# Altium schematic sheet Sheet2.SchDoc
size 420 x 297 mm; SheetNumber: 1; SheetTotal: 1
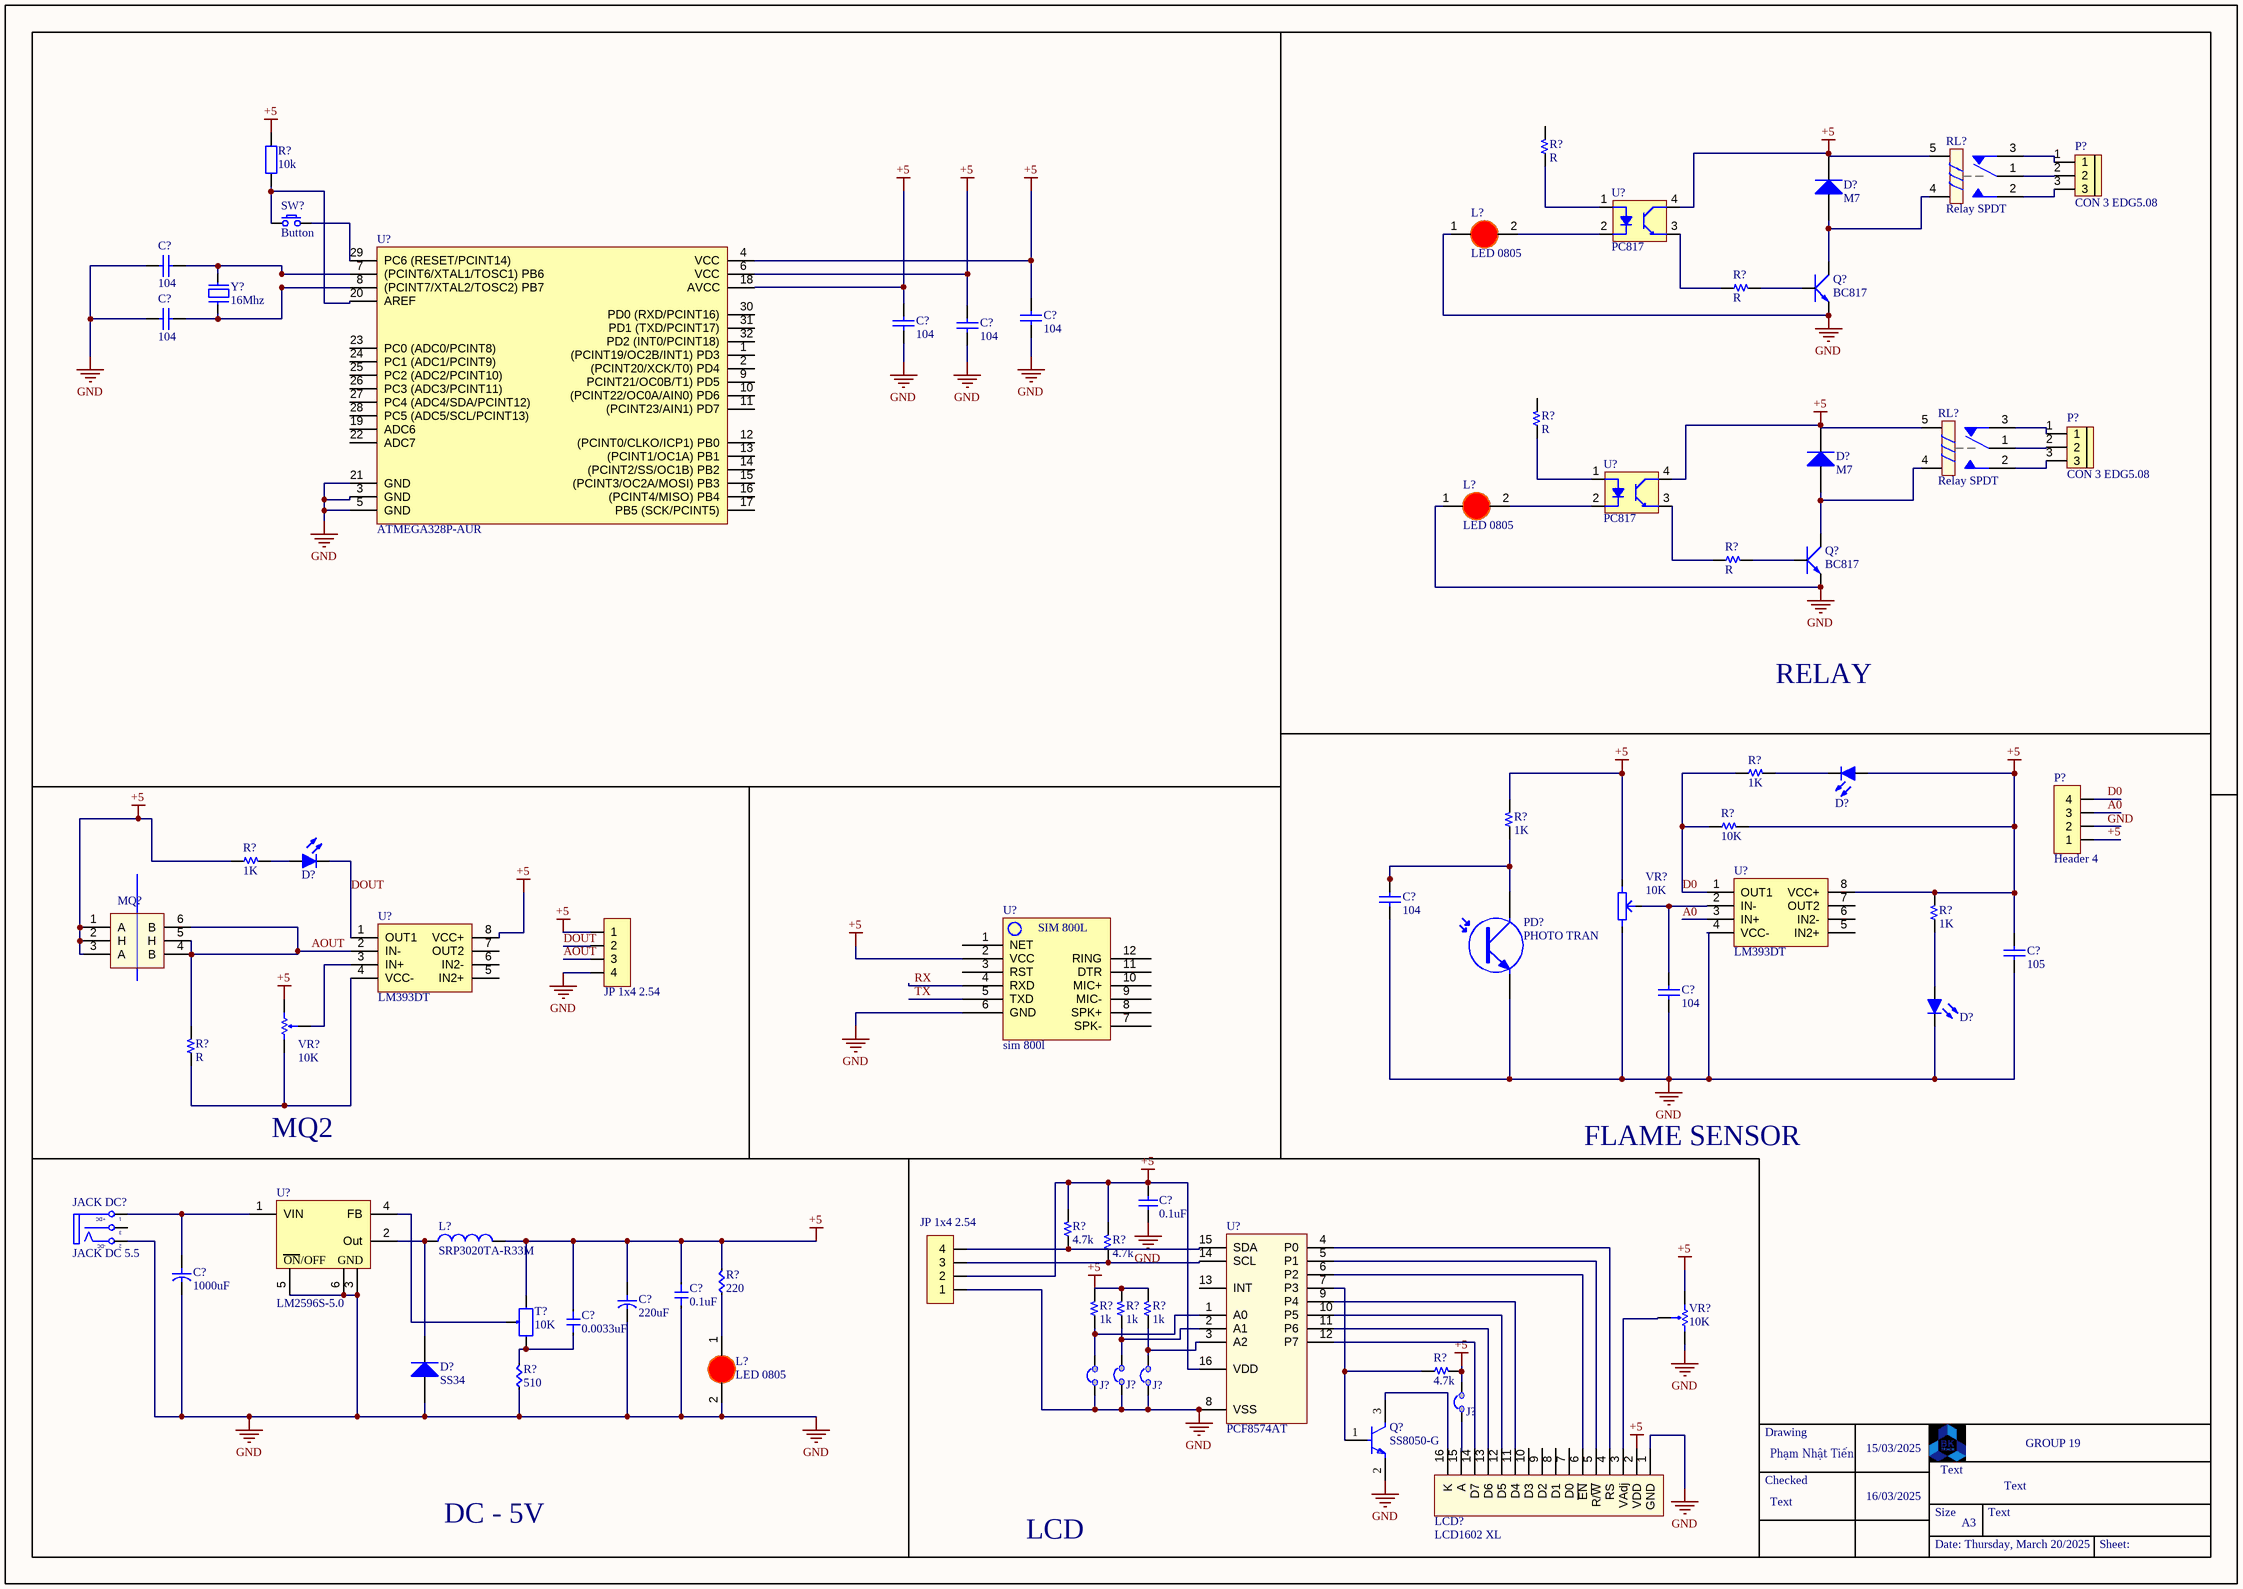
[diagram p0: Sheet2.SchDoc]

## Parts
(Parts that share a designator on the sheet are numbered #1, #2 ... from top to bottom, then left to right.)
C?#1  104  [tu 1206]
C?#2  104  [tu 1206]
C?#3  104  [tu 1206]
C?#4  104  [tu 1206]
C?#5  104  [tu 1206]
C?#6  104  [tu 0805]
C?#7  105  [tu 0805]
C?#8  104  [tu 0805]
C?#9  0.1uF  [C 0402 (1005)]
C?#10  1000uF  [C SMD ALU (F) DUAL]
C?#11  220uF  [C SMD ALU (F) DUAL]
C?#12  0.1uF  [Cap 0201]
C?#13  0.0033uF  [Cap 0201]
D?#1  M7  [DIODE SMA]
D?#2  M7  [DIODE SMA]
D?#3  Led  [Led 0603 - green]  (value not drawn)
D?#4  Led  [Led 0603 - green]  (value not drawn)
D?#5  Led  [Led 0603 - green]  (value not drawn)
D?#6  SS34  [DIODE SMA]
J?#1  JUMP 2  [JUMP/2/SMD/0402]  (value not drawn)  (no BOM)
J?#2  JUMP 2  [JUMP/2/SMD/0402]  (value not drawn)  (no BOM)
J?#3  JUMP 2  [JUMP/2/SMD/0402]  (value not drawn)  (no BOM)
J?#4  JUMP 2  [JUMP/2/Close]  (value not drawn)  (no BOM)
JACK_DC?  JACK DC 5.5  [JACK DC 5.5]
JP?#1  JP 1x4 2.54  [JP 1x4 DC]
JP?#2  JP 1x4 2.54  [JP 1x4 DC]
L?#1  LED 0805  [LED-0805-Red]
L?#2  LED 0805  [LED-0805-Red]
L?#3  SRP3020TA-R33M  [IND_456_640_236X117_SMD]
L?#4  LED 0805  [LED-0805-Red]
LCD?  LCD1602 XL  [LCD1602 with Jump]
MQ?  (no value)  [MQx]
P?#1  CON 3 EDG5.08  [CON 3 3EDG5.08]
P?#2  CON 3 EDG5.08  [CON 3 3EDG5.08]
P?#3  Header 4  [HDR/Header/4]
PD?  PHOTO TRAN  [LED-5TRED]
Q?#1  BC817  [SOT-23]
Q?#2  BC817  [SOT-23]
Q?#3  SS8050-G  [FP-SS8050-G-MFG]
R?#1  10k  [tro vach 1/4w]
R?#2  R  [R 1206]
R?#3  R  [R 1206]
R?#4  R  [R 1206]
R?#5  R  [R 1206]
R?#6  1K  [R 0603]
R?#7  10K  [R 0603]
R?#8  1K  [R 0603]
R?#9  1K  [R 0402 (1005)]
R?#10  1K  [R 0603]
R?#11  R  [R 0402 (1005)]
R?#12  4.7k  [R 0603]
R?#13  4.7k  [R 0603]
R?#14  220  [RES 0402]
R?#15  1k  [R 0402 (1005)]
R?#16  1k  [R 0402 (1005)]
R?#17  1k  [R 0402 (1005)]
R?#18  4.7k  [R 0402 (1005)]
R?#19  510  [RES 0402]
RL?#1  Relay SPDT  [RL_SPDT_10A]
RL?#2  Relay SPDT  [RL_SPDT_10A]
SW?  Button  [SW/2/DIP]
T?  10K  [Bien Tro Vi Chinh Dung]
U?#1  PC817  [SOP4 - PC817]
U?#2  ATMEGA328P-AUR  [TQFP-32]
U?#3  PC817  [SOP4 - PC817]
U?#4  LM393DT  [SOIC8_50_328_25X90_SMT]
U?#5  LM393DT  [SOIC8_50_328_25X90_SMT]
U?#6  sim 800l
U?#7  LM2596S-5.0  [TO-263-5]
U?#8  PCF8574AT  [SO16/PCF8574AT]
VR?#1  10K  [Bien Tro Tam Giac Dung]
VR?#2  10K  [R VAR A 3D]
VR?#3  10K  [R VAR A 3D]
Y?  16Mhz  [Thach Anh 2 chan SMD]

## Nets
+5: C?#3.1 C?#4.1 C?#5.1 C?#7.1 C?#9.1 C?#11.1 C?#12.1 C?#13.1 D?#1.2(K) D?#2.2(K) D?#3.1(A) J?#4.2 JP?#1.1 JP?#2.2 L?#3.2 LCD?.2(VDD) MQ?.1(A) MQ?.2(H) MQ?.3(A) P?#3.1 R?#1.2 R?#7.2 R?#8.2 R?#9.1 R?#10.2 R?#12.2 R?#13.2 R?#14.2 R?#18.2 RL?#1.5(COIL2) RL?#2.5(COIL2) T?.3 U?#1.4(C) U?#2.4(VCC) U?#2.6(VCC) U?#2.18(AVCC) U?#3.4(C) U?#4.8(VCC+) U?#5.8(VCC+) U?#6.2(VCC) U?#8.16(VDD) VR?#1.1 VR?#2.1 VR?#3.3
GND: C?#1.2 C?#2.2 C?#3.2 C?#4.2 C?#5.2 C?#6.2 C?#7.2 C?#8.2 C?#10.2 C?#11.2 C?#12.2 D?#5.2(K) D?#6.1(A) J?#1.1 J?#2.1 J?#3.1 JACK_DC?.2(TN) JP?#1.4 JP?#2.1 L?#1.1(A) L?#2.1(A) L?#4.2(K) LCD?.1(GND) P?#3.2 PD?.2(E) Q?#1.2(E) Q?#2.2(E) Q?#3.2(E) R?#19.1 U?#2.3(GND) U?#2.5(GND) U?#2.21(GND) U?#4.4(VCC-) U?#6.6(GND) U?#7.3(GND) U?#7.5(~{ON}/OFF) U?#7.6(PAD) U?#8.8(VSS) VR?#1.3 VR?#3.1
A0: P?#3.3 U?#4.3(IN+)
AOUT: JP?#1.3 MQ?.4(B) MQ?.5(H) MQ?.6(B) R?#11.2 U?#5.2(IN-)
D0: P?#3.4 R?#6.1 R?#7.1 U?#4.1(OUT1)
DOUT: D?#4.2(K) JP?#1.2 U?#5.1(OUT1)
RX: U?#6.4(RXD)
TX: U?#6.5(TXD)
NetC?#1_1: C?#1.1 U?#2.7((PCINT6/XTAL1/TOSC1)_PB6) Y?.2
NetC?#2_1: C?#2.1 U?#2.8((PCINT7/XTAL2/TOSC2)_PB7) Y?.1
NetC?#6_1: C?#6.1 PD?.1(C) R?#8.1
NetC?#8_1: C?#8.1 U?#4.2(IN-) VR?#1.2
NetC?#10_1: C?#10.1 JACK_DC?.1(T) U?#7.1(VIN)
NetC?#13_2: C?#13.2 R?#19.2 T?.1
NetD?#1_1: D?#1.1(A) Q?#1.3(C) RL?#1.4(COIL1)
NetD?#2_1: D?#2.1(A) Q?#2.3(C) RL?#2.4(COIL1)
NetD?#3_2: D?#3.2(K) R?#6.2
NetD?#4_1: D?#4.1(A) R?#9.2
NetD?#5_1: D?#5.1(A) R?#10.1
NetD?#6_2: D?#6.2(K) L?#3.1 U?#7.2(Out)
NetJ?#1_2: J?#1.2 R?#15.1 U?#8.1(A0)
NetJ?#2_2: J?#2.2 R?#16.1 U?#8.2(A1)
NetJ?#3_2: J?#3.2 R?#17.1 U?#8.3(A2)
NetJ?#4_1: J?#4.1 LCD?.15(A)
NetJP?#2_3: JP?#2.3 R?#13.1 U?#8.14(SCL)
NetJP?#2_4: JP?#2.4 R?#12.1 U?#8.15(SDA)
NetL?#1_2: L?#1.2(K) U?#1.2(K)
NetL?#2_2: L?#2.2(K) U?#3.2(K)
NetL?#4_1: L?#4.1(A) R?#14.1
NetLCD?_3: LCD?.3(VAdj) VR?#3.2
NetLCD?_4: LCD?.4(RS) U?#8.4(P0)
NetLCD?_5: LCD?.5(R/~{W}) U?#8.5(P1)
NetLCD?_6: LCD?.6(~{EN}) U?#8.6(P2)
NetLCD?_11: LCD?.11(D4) U?#8.9(P4)
NetLCD?_12: LCD?.12(D5) U?#8.10(P5)
NetLCD?_13: LCD?.13(D6) U?#8.11(P6)
NetLCD?_14: LCD?.14(D7) U?#8.12(P7)
NetLCD?_16: LCD?.16(K) Q?#3.3(C)
NetP?#1_1: P?#1.1 RL?#1.3(NC)
NetP?#1_2: P?#1.2 RL?#1.1(COM)
NetP?#1_3: P?#1.3 RL?#1.2(NO)
NetP?#2_1: P?#2.1 RL?#2.3(NC)
NetP?#2_2: P?#2.2 RL?#2.1(COM)
NetP?#2_3: P?#2.3 RL?#2.2(NO)
NetQ?#1_1: Q?#1.1(B) R?#3.2
NetQ?#2_1: Q?#2.1(B) R?#5.2
NetQ?#3_1: Q?#3.1(B) R?#18.1 U?#8.7(P3)
NetR?#1_1: R?#1.1 SW?.1 U?#2.20(AREF)
NetR?#2_1: R?#2.1 U?#1.1(A)
NetR?#3_1: R?#3.1 U?#1.3(E)
NetR?#4_1: R?#4.1 U?#3.1(A)
NetR?#5_1: R?#5.1 U?#3.3(E)
NetR?#11_1: R?#11.1 U?#5.4(VCC-) VR?#2.3
NetR?#15_2: R?#15.2 R?#16.2 R?#17.2
NetSW?_2: SW?.2 U?#2.29(PC6_(RESET/PCINT14))
NetT?_2: T?.2 U?#7.4(FB)
NetU?#5_3: U?#5.3(IN+) VR?#2.2

Not connected (* = marked no-connect by the designer): C?#9 2; JACK_DC? 3(S); LCD? 7(D0) 8(D1) 9(D2) 10(D3); R?#2 2; R?#4 2; U?#2 1((PCINT19/OC2B/INT1)_PD3) 2((PCINT20/XCK/T0)_PD4) 9(PCINT21/OC0B/T1)_PD5) 10((PCINT22/OC0A/AIN0)_PD6) 11((PCINT23/AIN1)_PD7) 12((PCINT0/CLKO/ICP1)_PB0) 13((PCINT1/OC1A)_PB1) 14((PCINT2/SS/OC1B)_PB2) 15((PCINT3/OC2A/MOSI)_PB3) 16((PCINT4/MISO)_PB4) 17(PB5_(SCK/PCINT5)) 19(ADC6) 22(ADC7) 23(PC0_(ADC0/PCINT8)) 24(PC1_(ADC1/PCINT9)) 25(PC2_(ADC2/PCINT10)) 26(PC3_(ADC3/PCINT11)) 27(PC4_(ADC4/SDA/PCINT12)) 28(PC5_(ADC5/SCL/PCINT13)) 30(PD0_(RXD/PCINT16)) 31(PD1_(TXD/PCINT17)) 32(PD2_(INT0/PCINT18)); U?#4 5(IN2+) 6(IN2-) 7(OUT2); U?#5 5(IN2+) 6(IN2-) 7(OUT2); U?#6 1(NET) 3(RST) 7(SPK-) 8(SPK+) 9(MIC-) 10(MIC+) 11(DTR) 12(RING); U?#8 13(INT)

## Notes on the sheet
- RELAY
- MQ2
- FLAME SENSOR
- DC - 5V
- LCD
- Labels drawn without touching a wire or pin: +5, GND
- Drawing
- Phạm Nhật Tiến
- 15/03/2025
- Text
- GROUP 19
- Checked
- 16/03/2025
- Size
- A3
- Date: Thursday, March 20/2025
- Sheet:
- (in symbol JACK DC 5.5) +DC; -DC
- (in symbol LM2596S-5.0) ON/OFF
- (in symbol sim 800l) SIM 800L

## Library data of the parts
C?#1-C?#5 = Tu 1206 104 50V 20%: Dán; Don_Vi: Con; So_Chan: 2; Ten_Linh_Kien: Tụ 1206 104-0.1uF 20% 50V; Ma_Hang: MH004544; Chung_Loai: Dán; Kieu_Chan: *
C?#6 C?#8 = Tu 0805 104 50V 10%: Dán; Don_Vi: Con; So_Chan: 2; Ten_Linh_Kien: Tụ 0805 104-100nF 10% 50V; Ma_Hang: MH004551; Chung_Loai: Dán; Kieu_Chan: *
C?#7 = Tu 0805 105 50V 10%: Dán; Don_Vi: Con; So_Chan: 2; Ten_Linh_Kien: Tụ 0805 105-1uF 10% 50V; Ma_Hang: MH004552; Chung_Loai: Dán; Kieu_Chan: *
C?#9 = Capacitor NP: Capacitor non-pol
C?#10 C?#11 = Capacitor: Capacitor pol
C?#12 C?#13 = Cap 0201: Capacitor SMD 0201
D?#1 D?#2 = Diode M7 ( 4007 ): Dán; Don_Vi: Con; Ten_Linh_Kien: Diode M7 1N4007 SMD 1A 1000V; Ma_Hang: MH000944; Chung_Loai: Dán; Ghi_Chu: *
D?#3-D?#5 = Led: Typical LED
D?#6 = Diode SS34 ( 1N5822 ): Dán; Don_Vi: Con; Ma_Hang: MH002104; Ten_Linh_Kien: Diode SS34 3A 40V SMA ( 1N5822 SS34A); Kieu_Chan: *; Chung_Loai: Dán
JACK_DC? = JACK DC 5.5: Value: Jac DC
JP?#1 JP?#2 = JP 1x4 2.54 Duc Cong: Cắm; Ten_Linh_Kien: Jump Đơn Đực 2.54MM 1x40P Cong Đứng; Don_Vi: Con; Ma_Hang: MH000904; Ghi_Chu: *; Kieu_Chan: *; Chung_Loai: Cắm
L?#1 L?#2 L?#4 = LED 0805 Do: Dán; Don_Vi: Con; Ma_Hang: MH000897; Ten_Linh_Kien: LED 0805 Màu Đỏ (Red); Ghi_Chu: *; Kieu_Chan: *; Chung_Loai: Dán
L?#3 = IND_33uH-8A-30%-SMD: Fixed Inductors 0.33uH 20% 8A; Manufacturer: Coilcraft; Alternate Part Number-1: NA; Manufacturer Part Number: SRP3020TA-R33M; Case/Package: SMD; Supplier-1: COILCRAFT SAMPLE; Supplier Part Number-1: SER2918H-333KL
LCD? = LCD1602 XL: LCD 1602 Xanh Lá; Ten: Màn hình LCD 1602 Xanh Lá; Ma_Hang: 67HZ; NCC: NSHOP; CHIP: HD44780
MQ? = MQX
P?#1 P?#2 = CON 3 EDG5.08: Cắm; Ten_Linh_Kien: CON 3 2EDG5.08-3P 5.08MM ( Xanh Cong); Ma_Hang: MH000760; Ghi_Chu: *; Kieu_Chan: *; Don_Vi: Con; Chung_Loai: Cắm
P?#3 = Header 4: Header, 4-Pin
Q?#1 Q?#2 = Trans BC817: SOT-23 - C8658; Value: C9014
Q?#3 = CMP-20235-000001-1: NPN TRANSISTOR 1.5A 40V SOT-23 R; Transition Frequency: 100MHz; Max Breakdown Voltage: 25V; Collector Emitter Voltage (VCEO): 400mV; Max Power Dissipation: 300mW; Max Collector Current: 1.5A; Case/Package: TO-236-3; Packaging: Tape and Reel; RoHS Compliant: Yes; Mount: Surface Mount; Collector Emitter Breakdown Voltage: 25V
R?#1 = Tro Vach 1/4W 5% 10k: Căm; Chung_Loai: Cắm; Don_Vi: Con; So_Chan: 2; Ten_Linh_Kien: Trở Vạch 1/4w 5% 10K; Ma_Hang: MH007354; Kieu_Chan: *
R?#2-R?#13 R?#15-R?#18 = Resistor
R?#14 R?#19 = RES 0402: RES SMD 0402; Manufacturer: Vishay Dale; Manufacturer Part Number: CRCW040210K0FKED; Resistance (Ohms): 10k; Tolerance: ±1%; Power (Watts): 0.063W, 1/16W; Temperature Coefficient: ±100ppm/°C; Supplier 1: Digi-Key; RoHS: RoHS Compliant; Category: Resistors; Stock 1: 2392462; Pricing 1: 10=0.083, 50=0.0444, 200=0.0255, 1000=0.0174 (USD); Packaging: Cut Tape (CT); Composition: Thick Film; Features: Automotive AEC-Q200; Operating Temperature: -55°C ~ 155°C; Package / Case: 0402 (1005 Metric); Supplier Device Package: 0402 (1005 Metric); Size / Dimension: 0.039" L x 0.020" W (1.00mm x 0.50mm); Height: 0.016" (0.40mm); Number of Terminations: 2; ComponentLink1URL: http://www.vishay.com/docs/20035/dcrcwe3.pdf; ComponentLink1Description: http://www.vishay.com/docs/20035/dcrcwe3.pdf; Supplier Part Number 1: 541-10.0KLCT-ND
SW? = SW SPST: Tact switch 2 pin
T? = Bien Tro Tinh Chinh 10K Dung: Cắm; Ma_Hang: MH003232; Ten_Linh_Kien: Biến Trở VR 103-10K 3296W; Don_Vi: Con; Kieu_Chan: *; Chung_Loai: Cắm; Ghi_Chu: *
U?#1 U?#3 = PC817: Opto PC817B
U?#2 = IC_ATMEGA328P: AVR AVR® ATmega Microcontroller IC 8-Bit 20MHz 32KB (16K x 16) FLASH 32-TQFP (7x7); Manufacturer: Microchip Technology; Alternate Part Number-1: NA; Manufacturer Part Number: ATMEGA328P-AUR; Case/Package: 32-TQFP; Supplier-1: Arrow; Supplier Part Number-1: ATMEGA328P-AUR
U?#4 U?#5 = IC_LM393DT: Comparator General Purpose CMOS, DTL, ECL, MOS, Open-Collector, TTL 8-SO; Manufacturer: Texas Instruments; Alternate Part Number-1: NA; Manufacturer Part Number: LM393DT; Case/Package: SOIC8; Supplier-1: ARROW; Supplier Part Number-1: LM393DT
U?#7 = LM2596S-5.0: Simple Switcher 3A Step-Down Voltage Regulator
U?#8 = PCF8574AT: Remote 8-bit I/O expander for I2C-bus with interrupt; PART NO: PCF8574AT/3; BRAND: NXP; PACKAGE: SO16; TYPE: SMD
VR?#1 = Bien tro tam giac 10K Dung: Cắm; Ma_Hang: MH000919; Don_Vi: Con; Ten_Linh_Kien: Biến Trở Tam Giác 103-10K RM065 (Chân Đứng); Chung_Loai: Cắm; Kieu_Chan: *
VR?#2 VR?#3 = Resistor Variable
Y? = Thach Anh 2 chan SMD: Crystal For all Crystal 2pin.; Value: 4Mhz
PD? = Photo TRAN: Published: 24-Mar-1999; LatestRevisionDate: 17-Jul-2002; LatestRevisionNote: Re-released for DXP Platform.; PackageReference: TO-220_A; Publisher: Altium Limited; Code_JEDEC: TO-220-AC